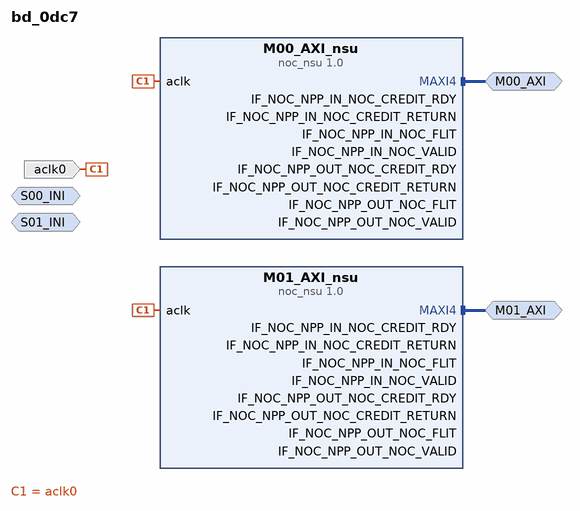
[diagram p0: block diagram of the top level]
# Vivado block design bd_0dc7, xcvc1902-vsvd1760-2MP-e-S, Vivado 2022.2
create_bd_design bd_0dc7

create_bd_intf_port -mode Slave -vlnv xilinx.com:interface:inimm_rtl:1.0 S00_INI
set_property -dict [list \
  CONFIG.CONNECTIONS {M00_AXI { read_bw {1720} write_bw {1720} read_avg_burst {64} write_avg_burst {64}} } \
  CONFIG.INI_STRATEGY load \
] [get_bd_intf_ports S00_INI]
create_bd_intf_port -mode Slave -vlnv xilinx.com:interface:inimm_rtl:1.0 S01_INI
set_property -dict [list \
  CONFIG.CONNECTIONS {M01_AXI { read_bw {1720} write_bw {1720} read_avg_burst {64} write_avg_burst {64}} } \
  CONFIG.INI_STRATEGY load \
] [get_bd_intf_ports S01_INI]
create_bd_intf_port -mode Master -vlnv xilinx.com:interface:aximm_rtl:1.0 M00_AXI
set_property -dict {CONFIG.APERTURES {{0x202_0580_0000 2M}} CONFIG.CATEGORY pl} [get_bd_intf_ports M00_AXI]
create_bd_intf_port -mode Master -vlnv xilinx.com:interface:aximm_rtl:1.0 M01_AXI
set_property -dict {CONFIG.APERTURES {{0x202_0400_0000 16M}} CONFIG.CATEGORY pl} [get_bd_intf_ports M01_AXI]
create_bd_port -dir I -type clk aclk0
set_property -dict {CONFIG.ASSOCIATED_BUSIF M00_AXI:M01_AXI} [get_bd_ports aclk0]

create_bd_cell -type ip -vlnv xilinx.com:ip:noc_nsu:1.0 M01_AXI_nsu
set_property -dict [list \
  CONFIG.ATTR_FILE nocattrs.dat \
  CONFIG.NOC_FREQ 1000 \
  CONFIG.USER_NOC_CATEGORY PL \
  CONFIG.USER_NOC_DATA512_WIDTH 512 \
  CONFIG.USER_NOC_NSU_WIDTH 512 \
  CONFIG.USER_PHYS_NAME NOC_NSU512_X0Y0 \
  CONFIG.USER_REG_AXI_LOOPBACK 0x0 \
  CONFIG.USER_REG_COMP_ID_INDEX0 0x00 \
  CONFIG.USER_REG_COMP_ID_INDEX1 0x01 \
  CONFIG.USER_REG_COMP_ID_MODE 0x0 \
  CONFIG.USER_REG_DISABLE_EX_MON 0x1 \
  CONFIG.USER_REG_DWIDTH 0x6 \
  CONFIG.USER_REG_ECC_CHK_EN 0x1 \
  CONFIG.USER_REG_FIXED_COMP_ID 0x0 \
  CONFIG.USER_REG_MODE_SELECT 0x0 \
  CONFIG.USER_REG_ODISABLE_AXI_RESP 0x0 \
  CONFIG.USER_REG_OUTSTANDING_RD_TXN 0x20 \
  CONFIG.USER_REG_OUTSTANDING_WR_TXN 0x20 \
  CONFIG.USER_REG_PAR_CHK 0x0 \
  CONFIG.USER_REG_RDTRK_VCA_TOKEN0 0x02 \
  CONFIG.USER_REG_RDTRK_VCA_TOKEN1 0x05 \
  CONFIG.USER_REG_RD_REQ_VC_MAP0 0x0 \
  CONFIG.USER_REG_RD_REQ_VC_MAP1 0x4 \
  CONFIG.USER_REG_RD_RESP_VC_MAP0 0x2 \
  CONFIG.USER_REG_RD_RESP_VC_MAP1 0x6 \
  CONFIG.USER_REG_RD_VCA_TOKEN0 0x04 \
  CONFIG.USER_REG_RD_VCA_TOKEN1 0x0A \
  CONFIG.USER_REG_SRC 0x240 \
  CONFIG.USER_REG_TBASE_AXI_TIMEOUT 0x2 \
  CONFIG.USER_REG_TBASE_TRK_TIMEOUT 0x2 \
  CONFIG.USER_REG_VMAP_OUT_RD_TOKEN0 0x02 \
  CONFIG.USER_REG_VMAP_OUT_RD_TOKEN1 0x05 \
  CONFIG.USER_REG_VMAP_OUT_WR_TOKEN0 0x0A \
  CONFIG.USER_REG_VMAP_OUT_WR_TOKEN1 0x04 \
  CONFIG.USER_REG_WRTRK_VCA_TOKEN0 0x0A \
  CONFIG.USER_REG_WRTRK_VCA_TOKEN1 0x04 \
  CONFIG.USER_REG_WR_REQ_VC_MAP0 0x1 \
  CONFIG.USER_REG_WR_REQ_VC_MAP1 0x5 \
  CONFIG.USER_REG_WR_RESP_VC_MAP0 0x3 \
  CONFIG.USER_REG_WR_RESP_VC_MAP1 0x7 \
  CONFIG.USER_REG_WR_VCA_TOKEN0 0x19 \
  CONFIG.USER_REG_WR_VCA_TOKEN1 0x0A \
] [get_bd_cells M01_AXI_nsu]
create_bd_cell -type ip -vlnv xilinx.com:ip:noc_nsu:1.0 M00_AXI_nsu
set_property -dict [list \
  CONFIG.ATTR_FILE nocattrs.dat \
  CONFIG.NOC_FREQ 1000 \
  CONFIG.USER_NOC_CATEGORY PL \
  CONFIG.USER_NOC_DATA512_WIDTH 128 \
  CONFIG.USER_NOC_NSU_WIDTH 512 \
  CONFIG.USER_PHYS_NAME NOC_NSU512_X0Y2 \
  CONFIG.USER_REG_AXI_LOOPBACK 0x0 \
  CONFIG.USER_REG_COMP_ID_INDEX0 0x00 \
  CONFIG.USER_REG_COMP_ID_INDEX1 0x01 \
  CONFIG.USER_REG_COMP_ID_MODE 0x0 \
  CONFIG.USER_REG_DISABLE_EX_MON 0x1 \
  CONFIG.USER_REG_DWIDTH 0x4 \
  CONFIG.USER_REG_ECC_CHK_EN 0x1 \
  CONFIG.USER_REG_FIXED_COMP_ID 0x0 \
  CONFIG.USER_REG_MODE_SELECT 0x0 \
  CONFIG.USER_REG_ODISABLE_AXI_RESP 0x0 \
  CONFIG.USER_REG_OUTSTANDING_RD_TXN 0x20 \
  CONFIG.USER_REG_OUTSTANDING_WR_TXN 0x20 \
  CONFIG.USER_REG_PAR_CHK 0x0 \
  CONFIG.USER_REG_RDTRK_VCA_TOKEN0 0x10 \
  CONFIG.USER_REG_RDTRK_VCA_TOKEN1 0x10 \
  CONFIG.USER_REG_RD_REQ_VC_MAP0 0x4 \
  CONFIG.USER_REG_RD_REQ_VC_MAP1 0x0 \
  CONFIG.USER_REG_RD_RESP_VC_MAP0 0x6 \
  CONFIG.USER_REG_RD_RESP_VC_MAP1 0x2 \
  CONFIG.USER_REG_RD_VCA_TOKEN0 0x10 \
  CONFIG.USER_REG_RD_VCA_TOKEN1 0x10 \
  CONFIG.USER_REG_SRC 0x040 \
  CONFIG.USER_REG_TBASE_AXI_TIMEOUT 0x2 \
  CONFIG.USER_REG_TBASE_TRK_TIMEOUT 0x2 \
  CONFIG.USER_REG_VMAP_OUT_RD_TOKEN0 0x10 \
  CONFIG.USER_REG_VMAP_OUT_RD_TOKEN1 0x10 \
  CONFIG.USER_REG_VMAP_OUT_WR_TOKEN0 0x10 \
  CONFIG.USER_REG_VMAP_OUT_WR_TOKEN1 0x10 \
  CONFIG.USER_REG_WRTRK_VCA_TOKEN0 0x10 \
  CONFIG.USER_REG_WRTRK_VCA_TOKEN1 0x10 \
  CONFIG.USER_REG_WR_REQ_VC_MAP0 0x1 \
  CONFIG.USER_REG_WR_REQ_VC_MAP1 0x5 \
  CONFIG.USER_REG_WR_RESP_VC_MAP0 0x3 \
  CONFIG.USER_REG_WR_RESP_VC_MAP1 0x7 \
  CONFIG.USER_REG_WR_VCA_TOKEN0 0x10 \
  CONFIG.USER_REG_WR_VCA_TOKEN1 0x10 \
] [get_bd_cells M00_AXI_nsu]

# ---- connections ----

connect_bd_intf_net [get_bd_intf_ports M00_AXI] [get_bd_intf_pins M00_AXI_nsu/MAXI4]
connect_bd_intf_net [get_bd_intf_ports M01_AXI] [get_bd_intf_pins M01_AXI_nsu/MAXI4]
connect_bd_net -net aclk0_1 [get_bd_ports aclk0] [get_bd_pins M01_AXI_nsu/aclk] [get_bd_pins M00_AXI_nsu/aclk]
# net m00_axi_nsu_if_noc_npp_in_noc_credit_rdy has one end: M00_AXI_nsu/IF_NOC_NPP_IN_NOC_CREDIT_RDY
# net m00_axi_nsu_if_noc_npp_in_noc_credit_return has one end: M00_AXI_nsu/IF_NOC_NPP_IN_NOC_CREDIT_RETURN
# net m00_axi_nsu_if_noc_npp_in_noc_flit has one end: M00_AXI_nsu/IF_NOC_NPP_IN_NOC_FLIT
# net m00_axi_nsu_if_noc_npp_in_noc_valid has one end: M00_AXI_nsu/IF_NOC_NPP_IN_NOC_VALID
# net m00_axi_nsu_if_noc_npp_out_noc_credit_rdy has one end: M00_AXI_nsu/IF_NOC_NPP_OUT_NOC_CREDIT_RDY
# net m00_axi_nsu_if_noc_npp_out_noc_credit_return has one end: M00_AXI_nsu/IF_NOC_NPP_OUT_NOC_CREDIT_RETURN
# net m00_axi_nsu_if_noc_npp_out_noc_flit has one end: M00_AXI_nsu/IF_NOC_NPP_OUT_NOC_FLIT
# net m00_axi_nsu_if_noc_npp_out_noc_valid has one end: M00_AXI_nsu/IF_NOC_NPP_OUT_NOC_VALID
# net m01_axi_nsu_if_noc_npp_in_noc_credit_rdy has one end: M01_AXI_nsu/IF_NOC_NPP_IN_NOC_CREDIT_RDY
# net m01_axi_nsu_if_noc_npp_in_noc_credit_return has one end: M01_AXI_nsu/IF_NOC_NPP_IN_NOC_CREDIT_RETURN
# net m01_axi_nsu_if_noc_npp_in_noc_flit has one end: M01_AXI_nsu/IF_NOC_NPP_IN_NOC_FLIT
# net m01_axi_nsu_if_noc_npp_in_noc_valid has one end: M01_AXI_nsu/IF_NOC_NPP_IN_NOC_VALID
# net m01_axi_nsu_if_noc_npp_out_noc_credit_rdy has one end: M01_AXI_nsu/IF_NOC_NPP_OUT_NOC_CREDIT_RDY
# net m01_axi_nsu_if_noc_npp_out_noc_credit_return has one end: M01_AXI_nsu/IF_NOC_NPP_OUT_NOC_CREDIT_RETURN
# net m01_axi_nsu_if_noc_npp_out_noc_flit has one end: M01_AXI_nsu/IF_NOC_NPP_OUT_NOC_FLIT
# net m01_axi_nsu_if_noc_npp_out_noc_valid has one end: M01_AXI_nsu/IF_NOC_NPP_OUT_NOC_VALID
set_property HDL_ATTRIBUTE.DONT_TOUCH true [get_bd_cells M01_AXI_nsu]
set_property HDL_ATTRIBUTE.DONT_TOUCH true [get_bd_cells M00_AXI_nsu]
set_property HDL_ATTRIBUTE.EXT_CONN TRUE [get_bd_nets m00_axi_nsu_if_noc_npp_in_noc_credit_rdy]
set_property HDL_ATTRIBUTE.HIDDEN TRUE [get_bd_nets m00_axi_nsu_if_noc_npp_in_noc_credit_rdy]
set_property HDL_ATTRIBUTE.SIM_ONLY TRUE [get_bd_nets m00_axi_nsu_if_noc_npp_in_noc_credit_rdy]
set_property HDL_ATTRIBUTE.EXT_CONN TRUE [get_bd_nets m00_axi_nsu_if_noc_npp_in_noc_credit_return]
set_property HDL_ATTRIBUTE.HIDDEN TRUE [get_bd_nets m00_axi_nsu_if_noc_npp_in_noc_credit_return]
set_property HDL_ATTRIBUTE.SIM_ONLY TRUE [get_bd_nets m00_axi_nsu_if_noc_npp_in_noc_credit_return]
set_property HDL_ATTRIBUTE.EXT_CONN TRUE [get_bd_nets m00_axi_nsu_if_noc_npp_in_noc_flit]
set_property HDL_ATTRIBUTE.HIDDEN TRUE [get_bd_nets m00_axi_nsu_if_noc_npp_in_noc_flit]
set_property HDL_ATTRIBUTE.SIM_ONLY TRUE [get_bd_nets m00_axi_nsu_if_noc_npp_in_noc_flit]
set_property HDL_ATTRIBUTE.EXT_CONN TRUE [get_bd_nets m00_axi_nsu_if_noc_npp_in_noc_valid]
set_property HDL_ATTRIBUTE.HIDDEN TRUE [get_bd_nets m00_axi_nsu_if_noc_npp_in_noc_valid]
set_property HDL_ATTRIBUTE.SIM_ONLY TRUE [get_bd_nets m00_axi_nsu_if_noc_npp_in_noc_valid]
set_property HDL_ATTRIBUTE.EXT_CONN TRUE [get_bd_nets m00_axi_nsu_if_noc_npp_out_noc_credit_rdy]
set_property HDL_ATTRIBUTE.HIDDEN TRUE [get_bd_nets m00_axi_nsu_if_noc_npp_out_noc_credit_rdy]
set_property HDL_ATTRIBUTE.SIM_ONLY TRUE [get_bd_nets m00_axi_nsu_if_noc_npp_out_noc_credit_rdy]
set_property HDL_ATTRIBUTE.EXT_CONN TRUE [get_bd_nets m00_axi_nsu_if_noc_npp_out_noc_credit_return]
set_property HDL_ATTRIBUTE.HIDDEN TRUE [get_bd_nets m00_axi_nsu_if_noc_npp_out_noc_credit_return]
set_property HDL_ATTRIBUTE.SIM_ONLY TRUE [get_bd_nets m00_axi_nsu_if_noc_npp_out_noc_credit_return]
set_property HDL_ATTRIBUTE.EXT_CONN TRUE [get_bd_nets m00_axi_nsu_if_noc_npp_out_noc_flit]
set_property HDL_ATTRIBUTE.HIDDEN TRUE [get_bd_nets m00_axi_nsu_if_noc_npp_out_noc_flit]
set_property HDL_ATTRIBUTE.SIM_ONLY TRUE [get_bd_nets m00_axi_nsu_if_noc_npp_out_noc_flit]
set_property HDL_ATTRIBUTE.EXT_CONN TRUE [get_bd_nets m00_axi_nsu_if_noc_npp_out_noc_valid]
set_property HDL_ATTRIBUTE.HIDDEN TRUE [get_bd_nets m00_axi_nsu_if_noc_npp_out_noc_valid]
set_property HDL_ATTRIBUTE.SIM_ONLY TRUE [get_bd_nets m00_axi_nsu_if_noc_npp_out_noc_valid]
set_property HDL_ATTRIBUTE.EXT_CONN TRUE [get_bd_nets m01_axi_nsu_if_noc_npp_in_noc_credit_rdy]
set_property HDL_ATTRIBUTE.HIDDEN TRUE [get_bd_nets m01_axi_nsu_if_noc_npp_in_noc_credit_rdy]
set_property HDL_ATTRIBUTE.SIM_ONLY TRUE [get_bd_nets m01_axi_nsu_if_noc_npp_in_noc_credit_rdy]
set_property HDL_ATTRIBUTE.EXT_CONN TRUE [get_bd_nets m01_axi_nsu_if_noc_npp_in_noc_credit_return]
set_property HDL_ATTRIBUTE.HIDDEN TRUE [get_bd_nets m01_axi_nsu_if_noc_npp_in_noc_credit_return]
set_property HDL_ATTRIBUTE.SIM_ONLY TRUE [get_bd_nets m01_axi_nsu_if_noc_npp_in_noc_credit_return]
set_property HDL_ATTRIBUTE.EXT_CONN TRUE [get_bd_nets m01_axi_nsu_if_noc_npp_in_noc_flit]
set_property HDL_ATTRIBUTE.HIDDEN TRUE [get_bd_nets m01_axi_nsu_if_noc_npp_in_noc_flit]
set_property HDL_ATTRIBUTE.SIM_ONLY TRUE [get_bd_nets m01_axi_nsu_if_noc_npp_in_noc_flit]
set_property HDL_ATTRIBUTE.EXT_CONN TRUE [get_bd_nets m01_axi_nsu_if_noc_npp_in_noc_valid]
set_property HDL_ATTRIBUTE.HIDDEN TRUE [get_bd_nets m01_axi_nsu_if_noc_npp_in_noc_valid]
set_property HDL_ATTRIBUTE.SIM_ONLY TRUE [get_bd_nets m01_axi_nsu_if_noc_npp_in_noc_valid]
set_property HDL_ATTRIBUTE.EXT_CONN TRUE [get_bd_nets m01_axi_nsu_if_noc_npp_out_noc_credit_rdy]
set_property HDL_ATTRIBUTE.HIDDEN TRUE [get_bd_nets m01_axi_nsu_if_noc_npp_out_noc_credit_rdy]
set_property HDL_ATTRIBUTE.SIM_ONLY TRUE [get_bd_nets m01_axi_nsu_if_noc_npp_out_noc_credit_rdy]
set_property HDL_ATTRIBUTE.EXT_CONN TRUE [get_bd_nets m01_axi_nsu_if_noc_npp_out_noc_credit_return]
set_property HDL_ATTRIBUTE.HIDDEN TRUE [get_bd_nets m01_axi_nsu_if_noc_npp_out_noc_credit_return]
set_property HDL_ATTRIBUTE.SIM_ONLY TRUE [get_bd_nets m01_axi_nsu_if_noc_npp_out_noc_credit_return]
set_property HDL_ATTRIBUTE.EXT_CONN TRUE [get_bd_nets m01_axi_nsu_if_noc_npp_out_noc_flit]
set_property HDL_ATTRIBUTE.HIDDEN TRUE [get_bd_nets m01_axi_nsu_if_noc_npp_out_noc_flit]
set_property HDL_ATTRIBUTE.SIM_ONLY TRUE [get_bd_nets m01_axi_nsu_if_noc_npp_out_noc_flit]
set_property HDL_ATTRIBUTE.EXT_CONN TRUE [get_bd_nets m01_axi_nsu_if_noc_npp_out_noc_valid]
set_property HDL_ATTRIBUTE.HIDDEN TRUE [get_bd_nets m01_axi_nsu_if_noc_npp_out_noc_valid]
set_property HDL_ATTRIBUTE.SIM_ONLY TRUE [get_bd_nets m01_axi_nsu_if_noc_npp_out_noc_valid]

validate_bd_design
save_bd_design
